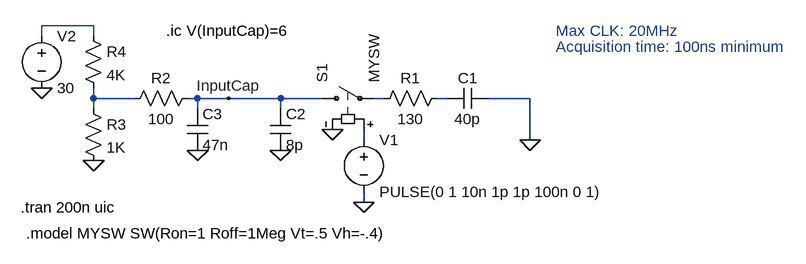
[diagram p0: schematic ADCInputSYM_withoutAMP.asc]
ADCInputSYM_withoutAMP.asc, the LTspice schematic file:
Version 4
SHEET 1 892 680
WIRE -208 80 -288 80
WIRE -288 96 -288 80
WIRE -208 96 -208 80
WIRE -208 192 -208 176
WIRE -144 192 -208 192
WIRE -48 192 -64 192
WIRE 0 192 -48 192
WIRE 80 192 0 192
WIRE 144 192 80 192
WIRE 240 192 224 192
WIRE 336 192 320 192
WIRE 464 192 400 192
WIRE -208 208 -208 192
WIRE -48 208 -48 192
WIRE 80 208 80 192
WIRE 208 256 208 240
WIRE 464 256 464 192
WIRE 208 352 208 336
FLAG 80 272 0
FLAG -48 272 0
FLAG 160 240 0
FLAG 208 352 0
FLAG 464 256 0
FLAG -208 288 0
FLAG -288 176 0
FLAG 0 192 InputCap
SYMBOL res 336 176 R90
WINDOW 0 0 56 VBottom 2
WINDOW 3 32 56 VTop 2
SYMATTR InstName R1
SYMATTR Value 130
SYMBOL cap 400 176 R90
WINDOW 0 0 32 VBottom 2
WINDOW 3 32 32 VTop 2
SYMATTR InstName C1
SYMATTR Value 40p
SYMBOL sw 128 192 R270
SYMATTR InstName S1
SYMATTR Value MYSW
SYMBOL cap 64 208 R0
SYMATTR InstName C2
SYMATTR Value 8p
SYMBOL cap -64 208 R0
SYMATTR InstName C3
SYMATTR Value 47n
SYMBOL res -48 176 R90
WINDOW 0 0 56 VBottom 2
WINDOW 3 32 56 VTop 2
SYMATTR InstName R2
SYMATTR Value 100
SYMBOL res -224 192 R0
SYMATTR InstName R3
SYMATTR Value 1K
SYMBOL res -224 80 R0
SYMATTR InstName R4
SYMATTR Value 4K
SYMBOL voltage 208 240 R0
WINDOW 123 0 0 Left 2
WINDOW 39 0 0 Left 2
SYMATTR InstName V1
SYMATTR Value PULSE(0 1 10n 1p 1p 100n 0 1)
SYMBOL voltage -288 80 R0
WINDOW 123 0 0 Left 2
WINDOW 39 0 0 Left 2
SYMATTR InstName V2
SYMATTR Value 30
TEXT -320 360 Left 2 !.tran 200n uic
TEXT -312 400 Left 2 !.model MYSW SW(Ron=1 Roff=1Meg Vt=.5 Vh=-.4)
TEXT -96 88 Left 2 !.ic V(InputCap)=6
TEXT 504 88 Left 2 ;Max CLK: 20MHz
TEXT 504 112 Left 2 ;Acquisition time: 100ns minimum

The netlist it stands for:
* ADCInputSYM_withoutAMP.asc
R1 N004 N003 130
C1 0 N004 40p
S1 InputCap N003 N005 0 MYSW
C2 InputCap 0 8p
C3 InputCap 0 47n
R2 InputCap N002 100
R3 N002 0 1K
R4 N001 N002 4K
V1 N005 0 PULSE(0 1 10n 1p 1p 100n 0 1)
V2 N001 0 30
.tran 200n uic
.model MYSW SW(Ron=1 Roff=1Meg Vt=.5 Vh=-.4)
.ic V(InputCap)=6
* Max CLK: 20MHz
* Acquisition time: 100ns minimum
.backanno
.end